# Altium project MSP430_Task.PrjPCB
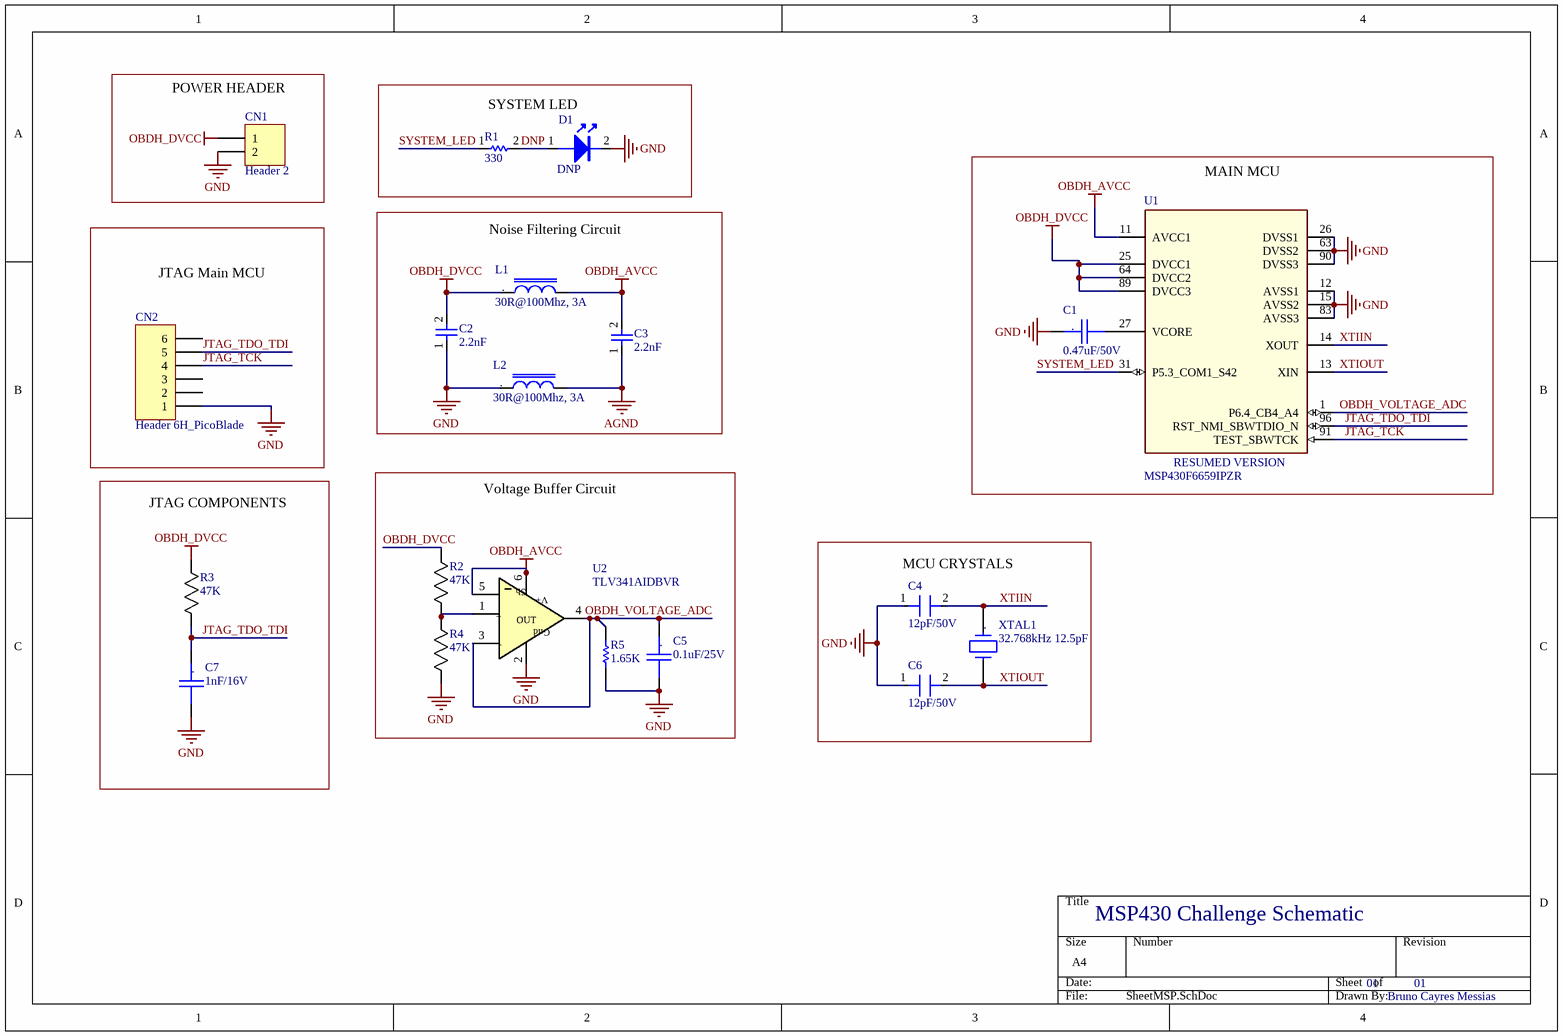
[diagram p0: SheetMSP.SchDoc]
1 sheet, 20 parts. Net scope: global (net labels, ports and power ports of the same name join across sheets).
Board file: MSP430_Task.PcbDoc

## Sheet SheetMSP.SchDoc
size A4

### Parts
C1  0.47uF/50V  [C0805_MD]
C2  2.2nF  [GRM155R71C222KA01D]
C3  2.2nF  [GRM155R71C222KA01D]
C4  12pF/50V  [Cap_12pf]
C5  0.1uF/25V  [C0805_MD]
C6  12pF/50V  [Cap_12pf]
C7  1nF/16V  [C0603_MD]
CN1  Header 2  [HEADER 2M 2.54mm 180 GRAUS]
CN2  Header 6H_PicoBlade  [PICO BLADE 0532610671]
D1  DNP  [L0805 GREEN]
L1  30R@100Mhz, 3A  [L0805]
L2  30R@100Mhz, 3A  [L0805]
R1  330  [R0603_MD]
R2  47K  [R0805_MD]
R3  47K  [R0805_MD]
R4  47K  [R0805_MD]
R5  1.65K  [R0805_MD]
U1  MSP430F6659IPZR  [PZ0100A_N]
U2  TLV341AIDBVR  [TLV341AIDBVR]
XTAL1  32.768kHz 12.5pF  [ABS06 0805]

### Blocks framed on the sheet
POWER HEADER: CN1
SYSTEM LED: D1 R1
MAIN MCU: C1 U1
JTAG Main MCU: CN2
Noise Filtering Circuit: C2 C3 L1 L2
JTAG COMPONENTS: C7 R3
Voltage Buffer Circuit: C5 R2 R4 R5 U2
MCU CRYSTALS: C4 C6 XTAL1

### Nets
AGND: C3.1 L2.2
GND: C1.1 C2.1 C4.1 C5.2 C6.1 C7.2 CN1.2 CN2.1 D1.2 L2.1 R4.2 R5.1 U1.12(AVSS1) U1.15(AVSS2) U1.26(DVSS1) U1.63(DVSS2) U1.83(AVSS3) U1.90(DVSS3) U2.2(Gnd)
OBDH_AVCC: C3.2 L1.2 U1.11(AVCC1) U2.5(EN) U2.6(V+)
OBDH_DVCC: C2.2 CN1.1 L1.1 R2.1 R3.1 U1.25(DVCC1) U1.64(DVCC2) U1.89(DVCC3)
DNP: D1.1 R1.2
JTAG_TCK: CN2.4 U1.91(TEST_SBWTCK)
JTAG_TDO_TDI: C7.1 CN2.5 R3.2 U1.96(RST_NMI_SBWTDIO_N)
OBDH_VOLTAGE_ADC: C5.1 R5.2 U1.1(P6.4_CB4_A4) U2.3(-IN) U2.4(OUT)
SYSTEM_LED: R1.1 U1.31(P5.3_COM1_S42)
XTIIN: C4.2 U1.14(XOUT) XTAL1.1
XTIOUT: C6.2 U1.13(XIN) XTAL1.2
NetC1_2: C1.2 U1.27(VCORE)
NetR2_2: R2.2 R4.1 U2.1(+IN)

Not connected (* = marked no-connect by the designer): CN2 2 3 6

### Notes on the sheet
- MSP430 Challenge Schematic
- 01
- Bruno Cayres Messias
- (in symbol Cap_Cer_X7R_0.1uF_25V_0805) .
- (in symbol Cap_Cer_X7R_0.47uF_50V_0805) .
- (in symbol Cap_Cer_X7R_1nF_16V_0603) .
- (in symbol FB_30R_3A_100MHz_0805) .
- (in symbol MSP430F6659IPZR) RESUMED VERSION
- (in symbol TLV341AIDBVR) Sh; +; -
- (in symbol Xtal_32.768kHz_12pF_2_SMD) .

### Library data of the parts
C1 = Cap_Cer_X7R_0.47uF_50V_0805: CAP CER 0.47UF 50V 10% X7R 0805; Partnumber: C0805C474K5RACTU; NCM: 8532.24.10
C2 C3 = Cap 2.2nF/16V_0402: Imported; Vendor: Murata; Built_By: EMA_UL_Team; Type: DEV; C: Copyright (C) 2015 Accelerated Designs. All rights reserved; Tolerance: 10%; Dielectric: X7R; Voltage Rating: 16V; Manufacturer_Part_Number: GRM155R71C222KA01D; RefDes: RefDes; Value: Value; Supplier 1: Digi-Key; Manufacturer: Murata; Manufacturer Part Number: GRM155R71C222KA01D; Stock 1: 125973; Pricing 1: 1=0.1, 10=0.03, 100=0.0134, 500=0.0096, 1000=0.0075, 2500=0.0068, 5000=0.0063 (USD); Mount: Surface Mount; Case/Package: 0402; Case Code (Metric): 1005; Case Code (Imperial): 0402; Min Operating Temperature: -55°C; Max Operating Temperature: 125°C; Capacitance: 2.2nF; Package Quantity: 10000; Packaging: Tape and Reel; Termination: SMD/SMT; Voltage Rating (DC): 16V; Length: 1mm; Height: 0.5mm; Width: 0.02inch; Thickness: 0.022inch; Depth: 0.5mm; Radiation Hardening: No; Lead Free: Lead Free; ComponentLink1URL: https://datasheet.ciiva.com/5412/product-5412216.pdf; ComponentLink1Description: https://datasheet.ciiva.com/5412/product-5412216.pdf; ComponentLink2URL: https://datasheet.ciiva.com/6263/partnumbering-e-01-6263624.pdf; ComponentLink2Description: https://datasheet.ciiva.com/6263/partnumbering-e-01-6263624.pdf; ComponentLink3URL: https://datasheet.ciiva.com/6263/partnumbering-e-01-6263627.pdf; ComponentLink3Description: https://datasheet.ciiva.com/6263/partnumbering-e-01-6263627.pdf; ComponentLink4URL: https://datasheet.ciiva.com/17453/product-17453067.pdf; ComponentLink4Description: https://datasheet.ciiva.com/17453/product-17453067.pdf; ComponentLink5URL: https://datasheet.ciiva.com/11620/product-11620860.pdf; ComponentLink5Description: https://datasheet.ciiva.com/11620/product-11620860.pdf; ComponentLink6URL: https://datasheet.ciiva.com/6263/partnumbering-e-01-6263630.pdf; ComponentLink6Description: https://datasheet.ciiva.com/6263/partnumbering-e-01-6263630.pdf; Supplier Part Number 1: 490-6330-1-ND
C4 C6 = CBR04C120F5GAC: KEMET - CBR04C120F5GAC - Capacitor, RF, C0G / NP0, 12 pF, 50 V, HiQ-CBR Series, ± 1%, 125 °C, 0402 [1005 Metric]; Capacitance: 12pF; Voltage Rating: 50V; Supplier 1: Newark; Supplier Part Number 1: 27AC1397; Manufacturer: KEMET; Manufacturer Part Number: CBR04C120F5GAC; Stock 1: 0; Mount: Surface Mount; Case/Package: 0402; Case Code (Metric): 1005; Case Code (Imperial): 0402; Contact Plating: Tin,Matte; Min Operating Temperature: -55°C; Max Operating Temperature: 125°C; Package Quantity: 1; Tolerance: 1%; Packaging: Tape and Reel; Dielectric: C0G; Voltage Rating (DC): 50V; Termination: Wraparound; Length: 0.039inch; Width: 0.02inch; Thickness: 0.022inch; ComponentLink1URL: https://api.kemet.com/component-edge/download/datasheet/CBR04C120F5GAC.pdf?src-supplier=Digi-Key; ComponentLink1Description: https://api.kemet.com/component-edge/download/datasheet/CBR04C120F5GAC.pdf?src-supplier=Digi-Key
C5 = Cap_Cer_X7R_0.1uF_25V_0805: CAP CER 0.1UF 25V 10% X7R 0805; Partnumber: CC0805KRX7R8BB104; NCM: 8532.24.10
C7 = Cap_Cer_X7R_1nF_16V_0603: CAP CER 1nF 16V 0603 5%; Partnumber: C0603X102J4RECAUTO; NCM: 8532.24.10
CN1 = Header 2: Header, 2-Pin; PartNumber: 826646-2; LatestRevisionDate: 17-Jul-2002; LatestRevisionNote: Re-released for DXP Platform.; Publisher: Altium Limited
CN2 = Header 6H_PicoBlade: Header, 6-Pin, Right Angle; Partnumber: 53398-0671; LatestRevisionDate: 17-Jul-2002; LatestRevisionNote: Re-released for DXP Platform.; Publisher: Altium Limited
D1 = LED/G_0805: SMD Green LED; Partnumber: LTST-C171GKT; NCM: 8541.40.21
L1 L2 = FB_30R_3A_100MHz_0805: Ferrite Bead 30 OHM 3A 100MHz; Partnumber: BLM21PG300SN1D; NCM: 8504.50.00
R1 = Resistor 330: Manufacturer: Vishay; Manufacturer Part Number: CRCW0603330RFKEAHP; Tolerance: 1%; Resistance: 330R; Temperature Coefficient: 100ppm/°C; Power Rating: 250mW; Voltage Rating: 75V; Supplier 1: Digi-Key; Stock 1: 0; Pricing 1: 1=0.18, 10=0.156, 100=0.0609, 1000=0.0255, 2500=0.0234 (USD); Mount: Surface Mount; Case/Package: 0603; Weight: 7.1E-05oz; Contact Plating: Tin; Case Code (Metric): 1608; Case Code (Imperial): 0603; Min Operating Temperature: -55°C; Max Operating Temperature: 155°C; Composition: Thick Film; Packaging: Tape and Reel; Package Quantity: 1; Number of Terminations: 2; Termination: SMD/SMT; Military Standard: Not; Max Power Dissipation: 250mW; Voltage Rating (DC): 75V; Length: 1.6mm; Height: 0.45mm; Width: 0.033inch; Depth: 0.85mm; Radiation Hardening: No; REACH SVHC: Unknown; Lead Free: Lead Free; ComponentLink1URL: https://datasheet.ciiva.com/48524/crcwhpe3-48524918.pdf; ComponentLink1Description: https://datasheet.ciiva.com/48524/crcwhpe3-48524918.pdf; ComponentLink2URL: https://datasheet.ciiva.com/8944/crcwhpe3-8944983.pdf; ComponentLink2Description: https://datasheet.ciiva.com/8944/crcwhpe3-8944983.pdf; ComponentLink3URL: https://datasheet.ciiva.com/6551/crcwhpe3-6551640.pdf; ComponentLink3Description: https://datasheet.ciiva.com/6551/crcwhpe3-6551640.pdf; ComponentLink4URL: https://datasheet.ciiva.com/6551/crcwhpe3-6551641.pdf; ComponentLink4Description: https://datasheet.ciiva.com/6551/crcwhpe3-6551641.pdf; ComponentLink5URL: https://datasheet.ciiva.com/6551/crcwhpe3-6551644.pdf; ComponentLink5Description: https://datasheet.ciiva.com/6551/crcwhpe3-6551644.pdf; ComponentLink6URL: https://datasheet.ciiva.com/16884/crcwhpe3-16884876.pdf; ComponentLink6Description: https://datasheet.ciiva.com/16884/crcwhpe3-16884876.pdf; ComponentLink7URL: https://datasheet.ciiva.com/12664/crcwhpe3-46056-12664527.pdf; ComponentLink7Description: https://datasheet.ciiva.com/12664/crcwhpe3-46056-12664527.pdf; Supplier Part Number 1: 541-330SCT-ND
R2-R4 = Resistor 47 Kohms: Imported; Manufacturer_Part_Number: ERA-6AEB473V; Manufacturer: Panasonic ECG; Vendor: Panasonic; Built_By: EMA_UL_Team; C: Copyright (C) 2015 Accelerated Designs. All rights reserved; Resistance: 47kR; Tolerance: 0.1%; Temperature Coefficient: 25ppm/°C; Power Rating: 125mW; Voltage Rating: 100V; RefDes: RefDes; Type: DEV; Value: Value; Supplier 1: Digi-Key; Manufacturer Part Number: ERA-6AEB473V; Stock 1: 186891; Pricing 1: 1=0.36, 10=0.302, 100=0.1182, 1000=0.0495, 2500=0.0454 (USD); Mount: Surface Mount; Case/Package: 0805; Number of Pins: 2; Weight: 0.000194oz; Contact Plating: Tin; Case Code (Metric): 2012; Case Code (Imperial): 0805; Min Operating Temperature: -55°C; Max Operating Temperature: 155°C; Composition: Metal Film,Thin Film; Packaging: Tape and Reel; Package Quantity: 1; Number of Terminations: 2; Termination: SMD/SMT; Military Standard: Not; Max Power Dissipation: 125mW; Voltage Rating (DC): 100V; Length: 2mm; Height: 0.5mm; Width: 1.25mm; Depth: 1.25mm; Radiation Hardening: No; REACH SVHC: No SVHC; Lead Free: Lead Free; ComponentLink1URL: https://datasheet.ciiva.com/6138/485442-6138021.pdf; ComponentLink1Description: https://datasheet.ciiva.com/6138/485442-6138021.pdf; ComponentLink2URL: https://datasheet.ciiva.com/16759/70068849-16759926.pdf; ComponentLink2Description: https://datasheet.ciiva.com/16759/70068849-16759926.pdf; ComponentLink3URL: https://datasheet.ciiva.com/22740/485442-22740326.pdf; ComponentLink3Description: https://datasheet.ciiva.com/22740/485442-22740326.pdf; ComponentLink4URL: https://datasheet.ciiva.com/30061/54aoa0000ce26-30061799.pdf; ComponentLink4Description: https://datasheet.ciiva.com/30061/54aoa0000ce26-30061799.pdf; ComponentLink5URL: https://datasheet.ciiva.com/11812/0900766b80beefcc-11812472.pdf; ComponentLink5Description: https://datasheet.ciiva.com/11812/0900766b80beefcc-11812472.pdf; ComponentLink6URL: https://datasheet.ciiva.com/7802/485442-7802329.pdf; ComponentLink6Description: https://datasheet.ciiva.com/7802/485442-7802329.pdf; ComponentLink7URL: https://datasheet.ciiva.com/16774/70068849-16774537.pdf; ComponentLink7Description: https://datasheet.ciiva.com/16774/70068849-16774537.pdf; ComponentLink8URL: https://datasheet.ciiva.com/48425/era-eng-tds-48425610.pdf; ComponentLink8Description: https://datasheet.ciiva.com/48425/era-eng-tds-48425610.pdf; ComponentLink9URL: https://datasheet.ciiva.com/17209/aoa0000ce26-17209676.pdf; ComponentLink9Description: https://datasheet.ciiva.com/17209/aoa0000ce26-17209676.pdf; ComponentLink10URL: https://datasheet.ciiva.com/43455/485442-43455277.pdf; ComponentLink10Description: https://datasheet.ciiva.com/43455/485442-43455277.pdf; ComponentLink11URL: https://datasheet.ciiva.com/48530/era-eng-tds-48530030.pdf; ComponentLink11Description: https://datasheet.ciiva.com/48530/era-eng-tds-48530030.pdf; ComponentLink12URL: https://datasheet.ciiva.com/26335/453548-da-01-en-widerstand-0805-era-26335717.pdf; ComponentLink12Description: https://datasheet.ciiva.com/26335/453548-da-01-en-widerstand-0805-era-26335717.pdf; Supplier Part Number 1: P47KDACT-ND
R5 = R1.65K_1%_1/10W_0805: RES 1.65K OHM 1/10W 0.1% 0805; Partnumber: PCF0805R-1K65BT1; NCM: 8533.21.20
U1 = MSP430F6659IPZR: Manufacturer: Texas Instruments; Number of I/Os: 74; Interface: SPI,USB,UART,I2C,IrDA,USART,SCI; RAM Size: 64KB; Number of Timers/Counters: 4; Max Supply Voltage: 3.6V; Min Supply Voltage: 1.8V; Data Bus Width: 16b; Frequency: 20MHz; Oscillator Type: Internal; Watchdog Timer: Yes; Memory Type: FLASH; Memory Size: 512KB; Number of UART Channels: 3; Number of A/D Converters: 16; Peripherals: Brown-out Detect/Reset,POR,PWM,WDT,DMA,LCD; Core Architecture: RISC; Supplier 1: Digi-Key; Supplier Part Number 1: 296-51438-1-ND; Stock 1: 497; Pricing 1: 1=11.93, 10=10.968, 25=10.5136, 100=9.2633, 250=8.80864, 500=8.24036 (USD); Mount: Surface Mount; Case/Package: LQFP; Number of Pins: 100; Min Operating Temperature: -40°C; Max Operating Temperature: 85°C; Packaging: Tape and Reel; Package Quantity: 1000; Number of Programmable I/O: 74; Max Frequency: 20MHz; Radiation Hardening: No; Lead Free: Lead Free; ComponentLink1URL: http://www.ti.com/lit/ds/symlink/msp430f6659.pdf?src-supplier=Digi-Key; ComponentLink1Description: http://www.ti.com/lit/ds/symlink/msp430f6659.pdf?src-supplier=Digi-Key; ComponentLink2URL: http://www.ti.com/lit/ds/symlink/msp430f5659.pdf?src-supplier=Avnet; ComponentLink2Description: http://www.ti.com/lit/ds/symlink/msp430f5659.pdf?src-supplier=Avnet; Supplier 2: Mouser; Supplier Part Number 2: 595-MSP430F6659IPZR; Stock 2: 0; Manufacturer Part Number: MSP430F6659IPZR
XTAL1 = Xtal_32.768kHz_12pF_2_SMD: 32.768kHz ±20ppm Crystal 12.5pF 70 kOhm -40°C ~ 125°C; Partnumber: ECS-.327-12.5-34S-TR; NCM: 8541.60.10
U2 = TLV341AIDBVR: Partnumber: TLV341AIDBVR; Supplier 1: Newark; Supplier Part Number 1: 73J8352